# Altium project PHC Daughter Board 1.PrjPcb
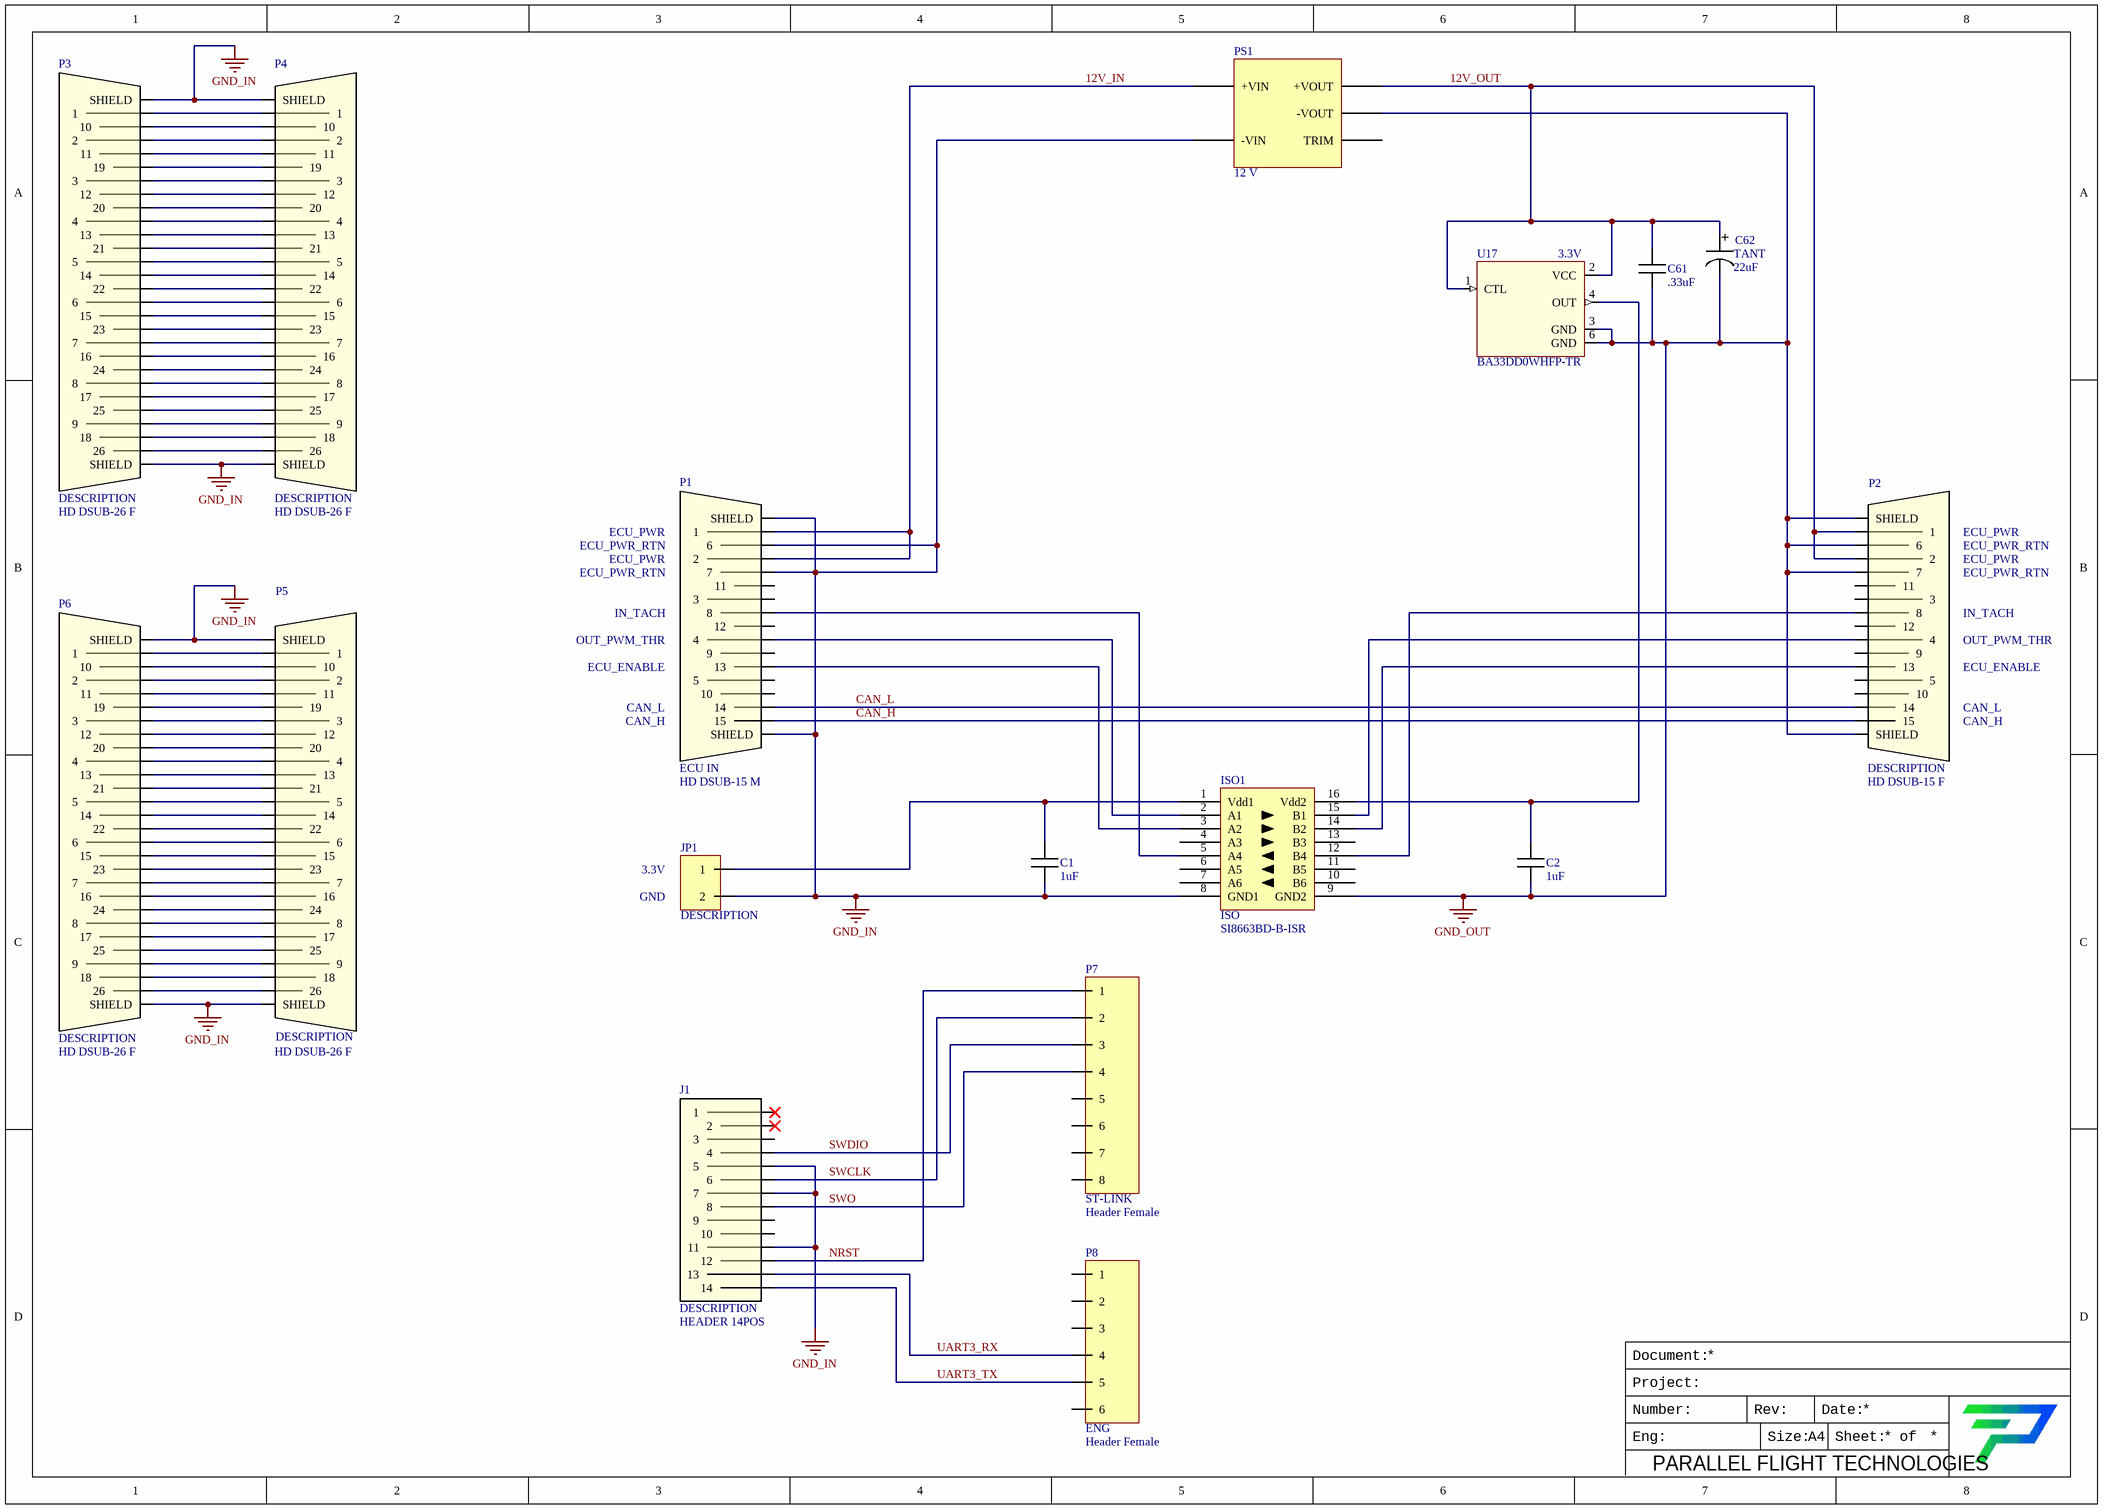
[diagram p0: IsolatorBoard.SchDoc]
1 sheet, 17 parts. Net scope: global (net labels, ports and power ports of the same name join across sheets).
Board file: IsolatorBoard.PcbDoc

## Sheet IsolatorBoard.SchDoc
size A3

### Parts
C1  value 1uF  [CAP 0805 CGA4]  (hidden comment: CAP 1uF 50V X5R SMT)
C2  value 1uF  [CAP 0805 CGA4]  (hidden comment: CAP 1uF 50V X5R SMT)
C61  value .33uF  [CAP 0805 CGA4]  (hidden comment: CAP .33uF SMT)
C62  TANT  value 22uF  [CAP TANT 1210]
ISO1  ISO  P/N: SI8663BD-B-ISR  [SOIC127ISO]
J1  DESCRIPTION  Type: HEADER 14POS  [Header .05" Pitch 14Pos]
JP1  DESCRIPTION  [HEADER 0.1" 2 PIN MALE]
P1  ECU IN  Type: HD DSUB-15 M  [DSUB HD 15P M Straight Board Locks]
P2  DESCRIPTION  Type: HD DSUB-15 F  [DSUB HD 15P F Straight Board Locks]
P3  DESCRIPTION  Type: HD DSUB-26 F  [DSUB HD 26P F Straight Board Locks]
P4  DESCRIPTION  Type: HD DSUB-26 F  [DSUB HD 26P F Straight Board Locks]
P5  DESCRIPTION  Type: HD DSUB-26 F  [DSUB HD 26P F Straight Board Locks]
P6  DESCRIPTION  Type: HD DSUB-26 F  [DSUB HD 26P F Straight Board Locks]
P7  ST-LINK  Type: Header Female  [HEADER 0.1" 8 PIN MALE]
P8  ENG  Type: Header Female  [HEADER 0.1" 6 PIN MALE]
PS1  12 V  [SKM30]
U17  3.3V  P/N: BA33DD0WHFP-TR  [HRP5 TO172P1054X2005-6N]

### Nets
GND_IN: C1.1 ISO1.8(GND1) J1.5 J1.7 J1.11 JP1.2 P1.6 P1.7 P1.16(SHIELD) P1.17(SHIELD) P3.27(SHIELD) P3.28(SHIELD) P4.27(SHIELD) P4.28(SHIELD) P5.27(SHIELD) P5.28(SHIELD) P6.27(SHIELD) P6.28(SHIELD) PS1.2(-VIN)
GND_OUT: C2.1 C61.1 C62.2(-) ISO1.9(GND2) P2.6 P2.7 P2.16(SHIELD) P2.17(SHIELD) PS1.5(-VOUT) U17.3(GND) U17.6(GND)
12V_IN: P1.1 P1.2 PS1.1(+VIN)
12V_OUT: C61.2 C62.1(+) P2.1 P2.2 PS1.4(+VOUT) U17.1(CTL) U17.2(VCC)
CAN_H: P1.15 P2.15
CAN_L: P1.14 P2.14
NRST: J1.12 P7.1
SWCLK: J1.6 P7.2
SWDIO: J1.4 P7.3
SWO: J1.8 P7.4
UART3_RX: J1.13 P8.4
UART3_TX: J1.14 P8.5
NetC1_2: C1.2 ISO1.1(Vdd1) JP1.1
NetC2_2: C2.2 ISO1.16(Vdd2) U17.4(OUT)
NetISO1_2: ISO1.2(A1) P1.4
NetISO1_3: ISO1.3(A2) P1.13
NetISO1_5: ISO1.5(A4) P1.8
NetISO1_12: ISO1.12(B4) P2.8
NetISO1_14: ISO1.14(B2) P2.13
NetISO1_15: ISO1.15(B1) P2.4
NetP3_1: P3.1 P4.1
NetP3_2: P3.2 P4.2
NetP3_3: P3.3 P4.3
NetP3_4: P3.4 P4.4
NetP3_5: P3.5 P4.5
NetP3_6: P3.6 P4.6
NetP3_7: P3.7 P4.7
NetP3_8: P3.8 P4.8
NetP3_9: P3.9 P4.9
NetP3_10: P3.10 P4.10
NetP3_11: P3.11 P4.11
NetP3_12: P3.12 P4.12
NetP3_13: P3.13 P4.13
NetP3_14: P3.14 P4.14
NetP3_15: P3.15 P4.15
NetP3_16: P3.16 P4.16
NetP3_17: P3.17 P4.17
NetP3_18: P3.18 P4.18
NetP3_19: P3.19 P4.19
NetP3_20: P3.20 P4.20
NetP3_21: P3.21 P4.21
NetP3_22: P3.22 P4.22
NetP3_23: P3.23 P4.23
NetP3_24: P3.24 P4.24
NetP3_25: P3.25 P4.25
NetP3_26: P3.26 P4.26
NetP5_1: P5.1 P6.1
NetP5_2: P5.2 P6.2
NetP5_3: P5.3 P6.3
NetP5_4: P5.4 P6.4
NetP5_5: P5.5 P6.5
NetP5_6: P5.6 P6.6
NetP5_7: P5.7 P6.7
NetP5_8: P5.8 P6.8
NetP5_9: P5.9 P6.9
NetP5_10: P5.10 P6.10
NetP5_11: P5.11 P6.11
NetP5_12: P5.12 P6.12
NetP5_13: P5.13 P6.13
NetP5_14: P5.14 P6.14
NetP5_15: P5.15 P6.15
NetP5_16: P5.16 P6.16
NetP5_17: P5.17 P6.17
NetP5_18: P5.18 P6.18
NetP5_19: P5.19 P6.19
NetP5_20: P5.20 P6.20
NetP5_21: P5.21 P6.21
NetP5_22: P5.22 P6.22
NetP5_23: P5.23 P6.23
NetP5_24: P5.24 P6.24
NetP5_25: P5.25 P6.25
NetP5_26: P5.26 P6.26

Not connected (* = marked no-connect by the designer): ISO1 4(A3) 6(A5) 7(A6) 10(B6) 11(B5) 13(B3); J1 1* 2* 3 9 10; P1 3 5 9 10 11 12; P2 3 5 9 10 11 12; P7 5 6 7 8; P8 1 2 3 6; PS1 6(TRIM)

### Notes on the sheet
- (near P1) ECU_PWR
- (near P1) ECU_PWR_RTN
- (near P2) ECU_PWR
- (near P2) ECU_PWR_RTN
- (near P1) IN_TACH
- (near P1) OUT_PWM_THR
- (near P2) IN_TACH
- (near P2) OUT_PWM_THR
- (near P1) CAN_L
- (near P1) CAN_H
- (near P1) ECU_ENABLE
- (near P2) CAN_L
- (near P2) CAN_H
- (near P2) ECU_ENABLE
- (near JP1) 3.3V
- (near JP1) GND
- Project:
- Document:
- Number:
- Eng:
- PARALLEL FLIGHT TECHNOLOGIES
- Rev:
- Size:
- A4
- Date:
- Sheet:
- of

### Library data of the parts
C1 C2 = CAP 1uF 50V X5R SMT: Capacitor 1uF X5R 50V 10% 0805 SMT; MFG: AVX; P/N: 08055D105KAT2A; PFT PN: 10062; PackageDescription: 0805
C61 = CAP .33uF SMT: Capacitor .33uF 50V 10% X7R 0805 SMT; MFG: TDK; P/N: CGA4J2X7R1H334K125AA
C62 = CAP TANT 22uF SMT: Capacitor Tantalum 22uF 20V 0.6Ohm SMT; MFG: AVX; P/N: TPSB226K020T0600; PFT PN: 10018; PackageDescription: 1210
ISO1 = IC DIGITAL ISOLATOR 6CH 3IN/3IN: 6Ch Digital Isolator 3inputs side 1 / 3 inputs side 2; MFG: Silicon Labs; Supplier 1: Mouser; Supplier Part Number 1: 634-SI8660BA-B-IS1
J1 = CON HEADER 14POS 0.05": HD D-Sub Connector 26 pin female vertical; MFG: Amphenol; P/N: 10090929-S264VLF
JP1 = JUMPER 2 POLE MALE HEADER: MFG: SAMTEC; P/N: TSW-102-07-F-S; PFT PN: 10028
P1 = CON HD DSUB 15P-M: HD D-Sub Connector 15 pin male vertical; MFG: Amphenol; P/N: 10090928-P154XLF
P2 = CON HD DSUB 15P-F: HD D-Sub Connector 15 pin female vertical; MFG: Amphenol; P/N: 10090929-S156VLF; PFT PN: 10033
P3-P6 = CON HD DSUB 26P-F: HD D-Sub Connector 26 pin female vertical; MFG: Amphenol; P/N: 10090929-S264VLF; PFT PN: 10034
P7 = CON HEADER FEMALE 8 POS 0.1": Header 8 position female 0.1"; MFG: Samtec; P/N: SSW-108-01-T-S; PFT PN: 10032
P8 = CON HEADER FEMALE 6 POS 0.1" SMT: Header 6 position female 0.1"; MFG: Samtec; P/N: SSW-106-22-F-S-VS-K; PFT PN: 10035
PS1 = POWER SUPPLY ISO 12V 2.5A 9~18Vin: Isolated power supply; MFG: Meanwell; P/N: SKM30A-12
U17 = VREG 3.3V 2A 25 IN MAX SMD: LDO Regulator Pos 3.3V 2A HRP SMD; MFG: Rohm; PFT PN: 10057; Package: TO-263-6 Rohm